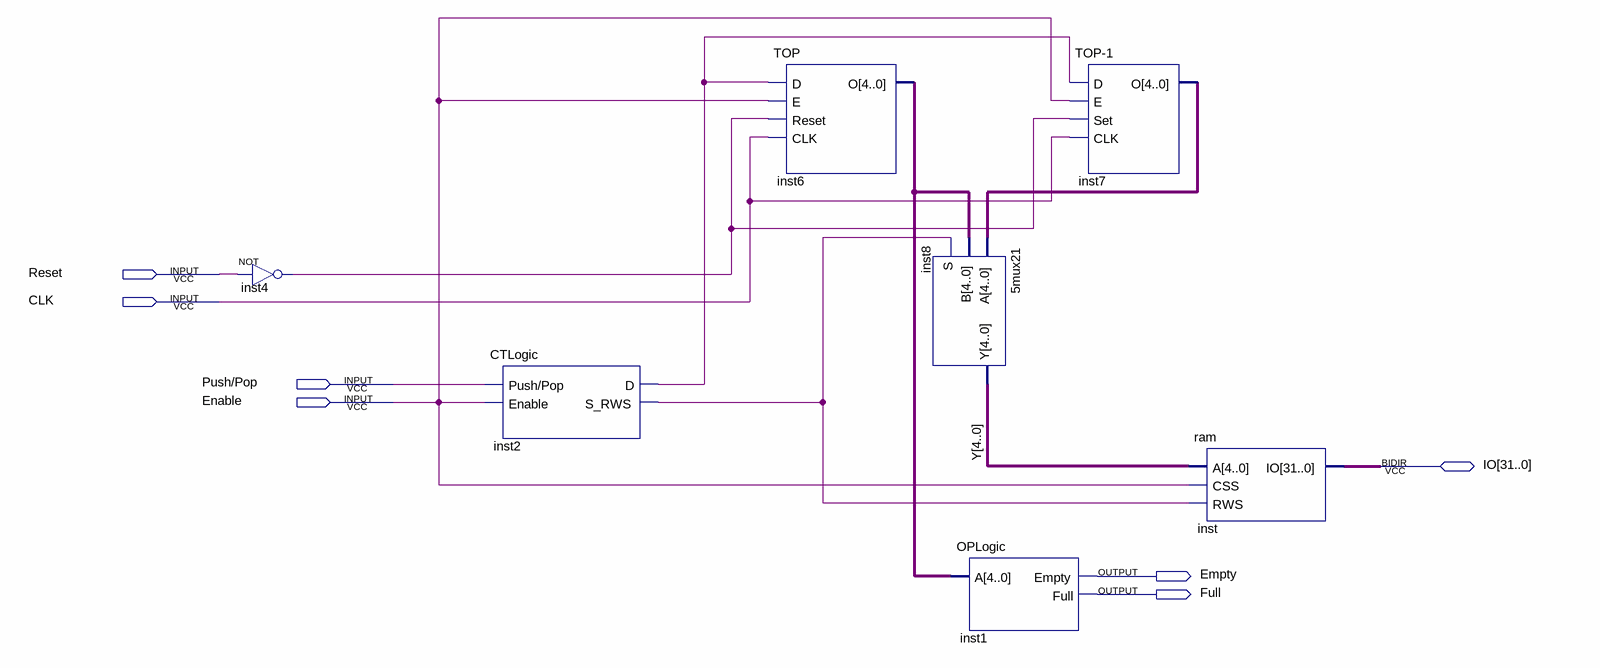
[diagram p0: schematic sheet]
// Quartus schematic PD.bdf as structural Verilog: 7 symbols, 7 pins
module PD (
  input  Reset,
  input  CLK,
  input  \Push/Pop ,
  input  Enable,
  inout  [31:0] IO,
  output Empty,
  output Full
);

  wire inst2_d, inst2_s_rws, inst4_out;
  wire [4:0] inst6_o, inst7_o, Y;

  not inst4 (inst4_out, Reset);
  CTLogic inst2 (.\Push/Pop (\Push/Pop ), .Enable(Enable), .D(inst2_d), .S_RWS(inst2_s_rws));
  TOP inst6 (.D(inst2_d), .E(Enable), .Reset(inst4_out), .CLK(CLK), .O(inst6_o));
  \5mux21  inst8 (.A(inst7_o), .B(inst6_o), .S(inst2_s_rws), .Y(Y));
  OPLogic inst1 (.A(inst6_o), .Empty(Empty), .Full(Full));
  \TOP-1  inst7 (.D(inst2_d), .E(Enable), .Set(inst4_out), .CLK(CLK), .O(inst7_o));
  ram inst (.A(Y), .CSS(Enable), .RWS(inst2_s_rws), .IO(IO));
endmodule
